# Altium project FTDI ToolKit.PrjPCB
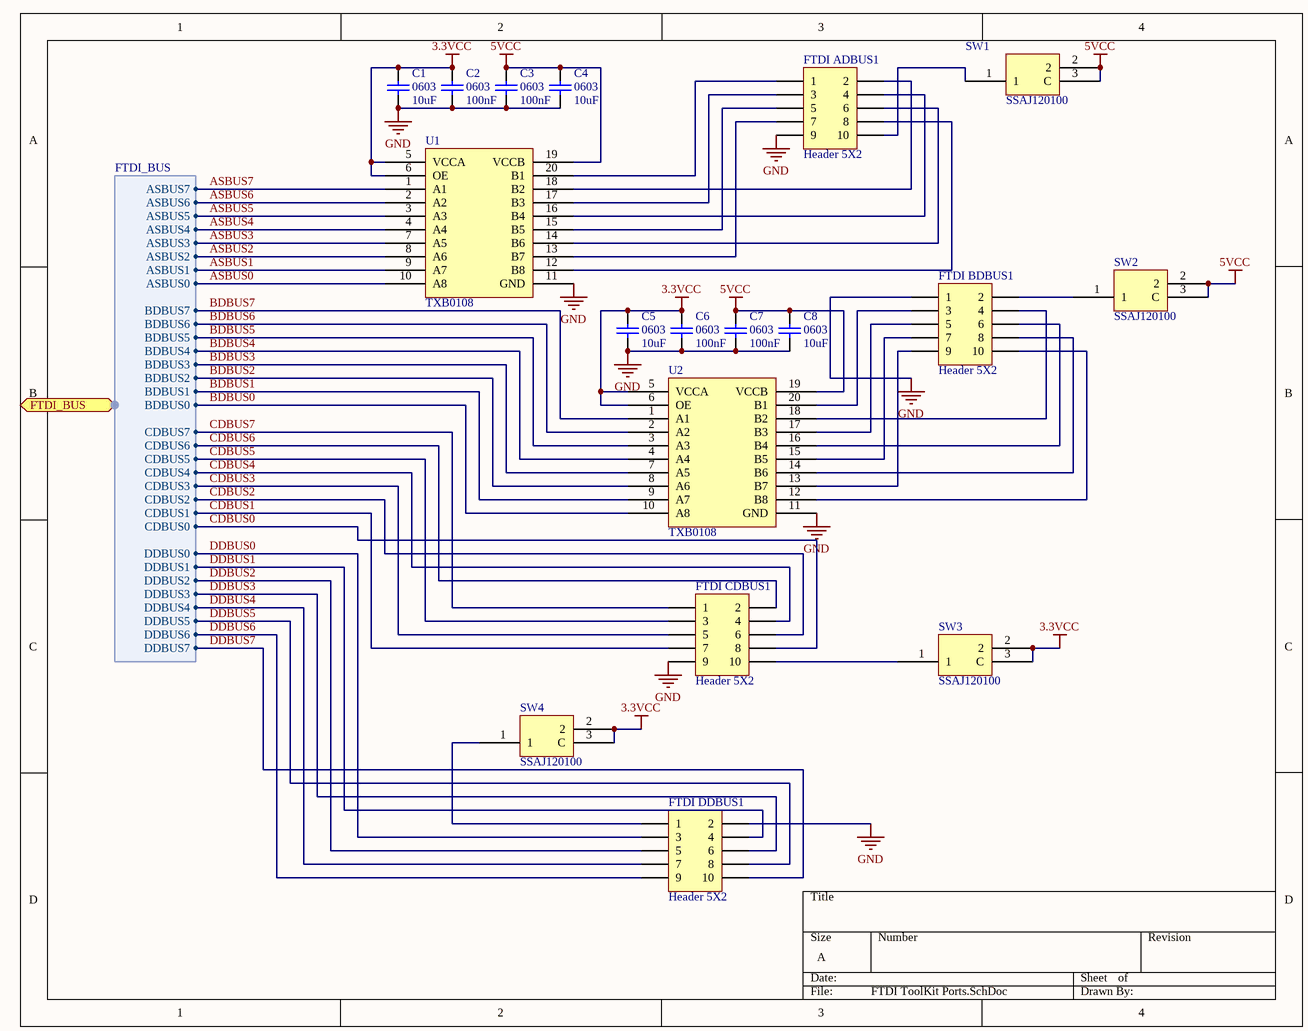
[diagram p0: FTDI ToolKit Ports.SchDoc]
2 sheets, 82 parts. Net scope: flat (ports and power ports of the same name join across sheets).
Board file: FTDI ToolKit.PcbDoc
Sheets:
  FTDI ToolKit Ports.SchDoc
  FTDI ToolKit FTDI & USB.SchDoc

## Sheet FTDI ToolKit Ports.SchDoc
size A

### Parts
C1  0603  value 10uF  [1608[0603]]
C2  0603  value 100nF  [1608[0603]]
C3  0603  value 100nF  [1608[0603]]
C4  0603  value 10uF  [1608[0603]]
C5  0603  value 10uF  [1608[0603]]
C6  0603  value 100nF  [1608[0603]]
C7  0603  value 100nF  [1608[0603]]
C8  0603  value 10uF  [1608[0603]]
FTDI_ADBUS1  Header 5X2  [HDR2X5]
FTDI_BDBUS1  Header 5X2  [HDR2X5]
FTDI_CDBUS1  Header 5X2  [HDR2X5]
FTDI_DDBUS1  Header 5X2  [HDR2X5]
SW1  SSAJ120100  [SSAJ120100]
SW2  SSAJ120100  [SSAJ120100]
SW3  SSAJ120100  [SSAJ120100]
SW4  SSAJ120100  [SSAJ120100]
U1  TXB0108  [TXB0108]
U2  TXB0108  [TXB0108]

### Ports
FTDI_BUS (harness FTDI_BUS)

### Harnesses
FTDI_BUS: BDBUS0, BDBUS1, BDBUS2, BDBUS3, BDBUS4, BDBUS5, BDBUS6, BDBUS7, CDBUS0, CDBUS1, CDBUS2, CDBUS3, CDBUS4, CDBUS5, CDBUS6, CDBUS7, DDBUS0, DDBUS1, DDBUS2, DDBUS3, DDBUS4, DDBUS5, DDBUS6, DDBUS7, ASBUS0, ASBUS1, ASBUS2, ASBUS3, ASBUS4, ASBUS5, ASBUS6, ASBUS7

### Nets
3.3VCC: C1.2 C2.2 C5.2 C6.2 SW3.2 SW3.3(C) SW4.2 SW4.3(C) U1.5(VCCA) U1.6(OE) U2.5(VCCA) U2.6(OE)
5VCC: C3.2 C4.2 C7.2 C8.2 SW1.2 SW1.3(C) SW2.2 SW2.3(C) U1.19(VCCB) U2.19(VCCB)
GND: C1.1 C2.1 C3.1 C4.1 C5.1 C6.1 C7.1 C8.1 FTDI_ADBUS1.9 FTDI_BDBUS1.1 FTDI_CDBUS1.9 FTDI_DDBUS1.2 U1.11(GND) U2.11(GND)
ASBUS0: U1.10(A8) ; port FTDI_BUS.ASBUS0
ASBUS1: U1.9(A7) ; port FTDI_BUS.ASBUS1
ASBUS2: U1.8(A6) ; port FTDI_BUS.ASBUS2
ASBUS3: U1.7(A5) ; port FTDI_BUS.ASBUS3
ASBUS4: U1.4(A4) ; port FTDI_BUS.ASBUS4
ASBUS5: U1.3(A3) ; port FTDI_BUS.ASBUS5
ASBUS6: U1.2(A2) ; port FTDI_BUS.ASBUS6
ASBUS7: U1.1(A1) ; port FTDI_BUS.ASBUS7
BDBUS0: U2.10(A8) ; port FTDI_BUS.BDBUS0
BDBUS1: U2.9(A7) ; port FTDI_BUS.BDBUS1
BDBUS2: U2.8(A6) ; port FTDI_BUS.BDBUS2
BDBUS3: U2.7(A5) ; port FTDI_BUS.BDBUS3
BDBUS4: U2.4(A4) ; port FTDI_BUS.BDBUS4
BDBUS5: U2.3(A3) ; port FTDI_BUS.BDBUS5
BDBUS6: U2.2(A2) ; port FTDI_BUS.BDBUS6
BDBUS7: U2.1(A1) ; port FTDI_BUS.BDBUS7
CDBUS0: FTDI_CDBUS1.8 ; port FTDI_BUS.CDBUS0
CDBUS1: FTDI_CDBUS1.7 ; port FTDI_BUS.CDBUS1
CDBUS2: FTDI_CDBUS1.6 ; port FTDI_BUS.CDBUS2
CDBUS3: FTDI_CDBUS1.5 ; port FTDI_BUS.CDBUS3
CDBUS4: FTDI_CDBUS1.4 ; port FTDI_BUS.CDBUS4
CDBUS5: FTDI_CDBUS1.3 ; port FTDI_BUS.CDBUS5
CDBUS6: FTDI_CDBUS1.2 ; port FTDI_BUS.CDBUS6
CDBUS7: FTDI_CDBUS1.1 ; port FTDI_BUS.CDBUS7
DDBUS0: FTDI_DDBUS1.3 ; port FTDI_BUS.DDBUS0
DDBUS1: FTDI_DDBUS1.4 ; port FTDI_BUS.DDBUS1
DDBUS2: FTDI_DDBUS1.5 ; port FTDI_BUS.DDBUS2
DDBUS3: FTDI_DDBUS1.6 ; port FTDI_BUS.DDBUS3
DDBUS4: FTDI_DDBUS1.7 ; port FTDI_BUS.DDBUS4
DDBUS5: FTDI_DDBUS1.8 ; port FTDI_BUS.DDBUS5
DDBUS6: FTDI_DDBUS1.9 ; port FTDI_BUS.DDBUS6
DDBUS7: FTDI_DDBUS1.10 ; port FTDI_BUS.DDBUS7
NetFTDI_ADBUS1_1: FTDI_ADBUS1.1 U1.20(B1)
NetFTDI_ADBUS1_2: FTDI_ADBUS1.2 U1.18(B2)
NetFTDI_ADBUS1_3: FTDI_ADBUS1.3 U1.17(B3)
NetFTDI_ADBUS1_4: FTDI_ADBUS1.4 U1.16(B4)
NetFTDI_ADBUS1_5: FTDI_ADBUS1.5 U1.15(B5)
NetFTDI_ADBUS1_6: FTDI_ADBUS1.6 U1.14(B6)
NetFTDI_ADBUS1_7: FTDI_ADBUS1.7 U1.13(B7)
NetFTDI_ADBUS1_8: FTDI_ADBUS1.8 U1.12(B8)
NetFTDI_ADBUS1_10: FTDI_ADBUS1.10 SW1.1
NetFTDI_BDBUS1_2: FTDI_BDBUS1.2 SW2.1
NetFTDI_BDBUS1_3: FTDI_BDBUS1.3 U2.20(B1)
NetFTDI_BDBUS1_4: FTDI_BDBUS1.4 U2.18(B2)
NetFTDI_BDBUS1_5: FTDI_BDBUS1.5 U2.17(B3)
NetFTDI_BDBUS1_6: FTDI_BDBUS1.6 U2.16(B4)
NetFTDI_BDBUS1_7: FTDI_BDBUS1.7 U2.15(B5)
NetFTDI_BDBUS1_8: FTDI_BDBUS1.8 U2.14(B6)
NetFTDI_BDBUS1_9: FTDI_BDBUS1.9 U2.13(B7)
NetFTDI_BDBUS1_10: FTDI_BDBUS1.10 U2.12(B8)
NetFTDI_CDBUS1_10: FTDI_CDBUS1.10 SW3.1
NetFTDI_DDBUS1_1: FTDI_DDBUS1.1 SW4.1

### Library data of the parts
C1-C8 = Cap Semi: Capacitor (Semiconductor SIM Model); Published: 8-Jun-2000; LatestRevisionDate: 29-May-2009; LatestRevisionNote: IPC-7351 Footprint Added.; PackageReference: C1206; Publisher: Altium Limited; PackageDescription: Chip Capacitor
FTDI_ADBUS1 FTDI_BDBUS1 FTDI_CDBUS1 FTDI_DDBUS1 = Header 5X2: Header, 5-Pin, Dual row; LatestRevisionDate: 17-Jul-2002; LatestRevisionNote: Re-released for DXP Platform.; Publisher: Altium Limited
SW1-SW4 = SSAJ120100: Slide Switch SMD
U1 U2 = TXB0108: Ti TXB0108 Bidirectional Level Translator

## Sheet FTDI ToolKit FTDI & USB.SchDoc
size B
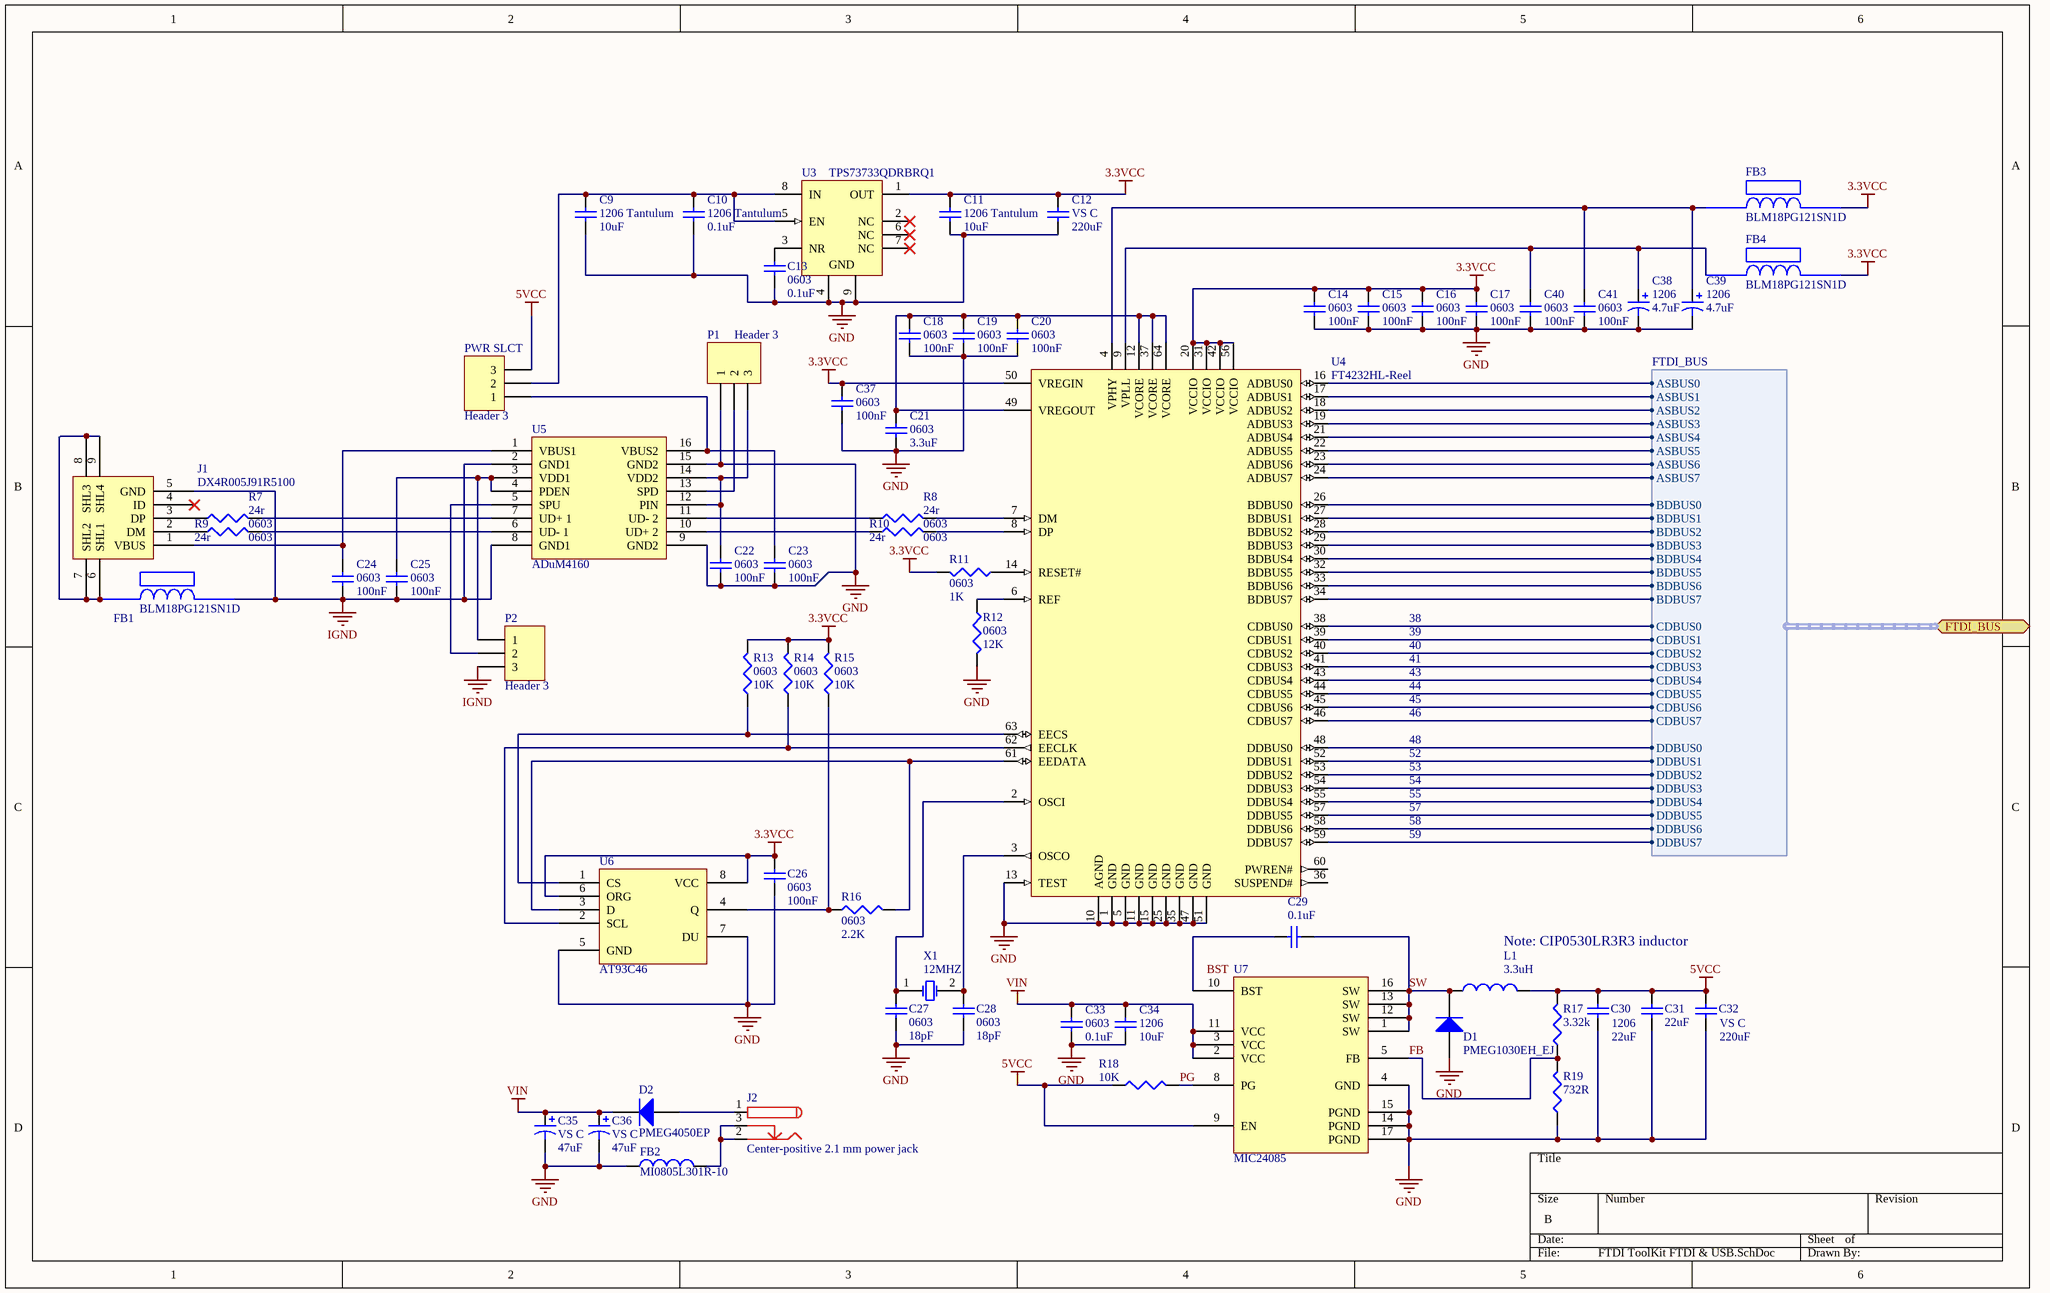
[diagram p1: FTDI ToolKit FTDI & USB.SchDoc]

### Parts
C9  1206 Tantulum  value 10uF  [C1206]
C10  1206 Tantulum  value 0.1uF  [C1206]
C11  1206 Tantulum  value 10uF  [C1206]
C12  VS C  value 220uF  [Panasonic VS C]
C13  0603  value 0.1uF  [1608[0603]]
C14  0603  value 100nF  [1608[0603]]
C15  0603  value 100nF  [1608[0603]]
C16  0603  value 100nF  [1608[0603]]
C17  0603  value 100nF  [1608[0603]]
C18  0603  value 100nF  [1608[0603]]
C19  0603  value 100nF  [1608[0603]]
C20  0603  value 100nF  [1608[0603]]
C21  0603  value 3.3uF  [1608[0603]]
C22  0603  value 100nF  [1608[0603]]
C23  0603  value 100nF  [1608[0603]]
C24  0603  value 100nF  [1608[0603]]
C25  0603  value 100nF  [1608[0603]]
C26  0603  value 100nF  [1608[0603]]
C27  0603  value 18pF  [1608[0603]]
C28  0603  value 18pF  [1608[0603]]
C29  value 0.1uF  [1608[0603]]  (hidden comment: Cap Semi)
C30  1206  value 22uF  [C1206]
C31  value 22uF  [C1206]  (hidden comment: Cap Semi)
C32  VS C  value 220uF  [Panasonic VS C]
C33  0603  value 0.1uF  [1608[0603]]
C34  1206  value 10uF  [C1206]
C35  VS C  value 47uF  [Panasonic VS C]
C36  VS C  value 47uF  [Panasonic VS C]
C37  0603  value 100nF  [1608[0603]]
C38  1206  value 4.7uF  [C1206POL]
C39  1206  value 4.7uF  [C1206POL]
C40  0603  value 100nF  [1608[0603]]
C41  0603  value 100nF  [1608[0603]]
D1  PMEG1030EH_EJ  [PMEG1030EH_EJ]
D2  PMEG4050EP  [PMEG4050EP]
FB1  BLM18PG121SN1D  [BLM18PG121SN1D]
FB2  MI0805L301R-10  [SM 0805 - gap trimmed]
FB3  BLM18PG121SN1D  [BLM18PG121SN1D]
FB4  BLM18PG121SN1D  [BLM18PG121SN1D]
J1  DX4R005J91R5100  [Micro USB Circular Holes Only]
J2  Center-positive 2.1 mm power jack  [PJ-102AH]
L1  value 3.3uH  [CIP0530LR3R3]  (hidden comment: Inductor)
P1  Header 3  [HDR1X3]
P2  Header 3  [HDR1X3]
PWR_SLCT  Header 3  [HDR1X3]
R7  0603  value 24r  [J1-0603]
R8  0603  value 24r  [J1-0603]
R9  0603  value 24r  [J1-0603]
R10  0603  value 24r  [J1-0603]
R11  0603  value 1K  [J1-0603]
R12  0603  value 12K  [J1-0603]
R13  0603  value 10K  [J1-0603]
R14  0603  value 10K  [J1-0603]
R15  0603  value 10K  [J1-0603]
R16  0603  value 2.2K  [J1-0603]
R17  value 3.32k  [J1-0603]  (hidden comment: Res3)
R18  value 10K  [J1-0603]  (hidden comment: Res3)
R19  value 732R  [J1-0603]  (hidden comment: Res3)
U3  TPS73733QDRBRQ1  [TI-DRB8-1750X1500TP_V]
U4  FT4232HL-Reel  [LQFP-64_N]
U5  ADuM4160  [ADuM4160]
U6  AT93C46  [SOIC127P600X175-8N]
U7  MIC24085  [MIC24085-AYML]
X1  12MHZ  [445C35A12M00000]

### Ports
FTDI_BUS (harness FTDI_BUS)

### Harnesses
FTDI_BUS: ASBUS0, ASBUS1, ASBUS2, ASBUS3, ASBUS4, ASBUS5, ASBUS6, ASBUS7, BDBUS0, BDBUS1, BDBUS2, BDBUS3, BDBUS4, BDBUS5, BDBUS6, BDBUS7, CDBUS0, CDBUS1, CDBUS2, CDBUS3, CDBUS4, CDBUS5, CDBUS6, CDBUS7, DDBUS0, DDBUS1, DDBUS2, DDBUS3, DDBUS4, DDBUS5, DDBUS6, DDBUS7

### Nets
3.3VCC: C11.1 C12.1 C14.2 C15.2 C16.2 C17.2 C26.2 C37.2 FB3.2 FB4.2 R11.2 R13.2 R14.2 R15.2 U3.1(OUT) U4.20(VCCIO) U4.31(VCCIO) U4.42(VCCIO) U4.50(VREGIN) U4.56(VCCIO) U6.6(ORG) U6.8(VCC)
5VCC: C30.2 C31.1 C32.1 L1.2 PWR_SLCT.3 R17.2 R18.1 U7.9(EN)
GND: C9.2 C10.1 C11.2 C12.2 C13.1 C14.1 C15.1 C16.1 C17.1 C18.1 C19.1 C20.1 C21.1 C22.1 C23.1 C26.1 C27.1 C28.1 C30.1 C31.2 C32.2 C33.1 C34.1 C35.2 C36.2 C37.1 C38.2 C39.2 C40.1 C41.1 D1.1(A) FB2.1 P1.1 R12.2 R19.1 U3.4(GND) U3.9(GND) U4.1(GND) U4.5(GND) U4.10(AGND) U4.11(GND) U4.13(TEST) U4.15(GND) U4.25(GND) U4.35(GND) U4.47(GND) U4.51(GND) U5.9(GND2) U5.15(GND2) U6.5(GND) U6.7(DU) U7.4(GND) U7.14(PGND) U7.15(PGND) U7.17(PGND)
IGND: C24.1 C25.1 FB1.2 J1.5(GND) P2.3 U5.2(GND1) U5.8(GND1)
VIN: C33.2 C34.2 C35.1 C36.1 D2.1(A) U7.2(VCC) U7.3(VCC) U7.11(VCC)
ASBUS0: U4.16(ADBUS0) ; port FTDI_BUS.ASBUS0
ASBUS1: U4.17(ADBUS1) ; port FTDI_BUS.ASBUS1
ASBUS2: U4.18(ADBUS2) ; port FTDI_BUS.ASBUS2
ASBUS3: U4.19(ADBUS3) ; port FTDI_BUS.ASBUS3
ASBUS4: U4.21(ADBUS4) ; port FTDI_BUS.ASBUS4
ASBUS5: U4.22(ADBUS5) ; port FTDI_BUS.ASBUS5
ASBUS6: U4.23(ADBUS6) ; port FTDI_BUS.ASBUS6
ASBUS7: U4.24(ADBUS7) ; port FTDI_BUS.ASBUS7
BDBUS0: U4.26(BDBUS0) ; port FTDI_BUS.BDBUS0
BDBUS1: U4.27(BDBUS1) ; port FTDI_BUS.BDBUS1
BDBUS2: U4.28(BDBUS2) ; port FTDI_BUS.BDBUS2
BDBUS3: U4.29(BDBUS3) ; port FTDI_BUS.BDBUS3
BDBUS4: U4.30(BDBUS4) ; port FTDI_BUS.BDBUS4
BDBUS5: U4.32(BDBUS5) ; port FTDI_BUS.BDBUS5
BDBUS6: U4.33(BDBUS6) ; port FTDI_BUS.BDBUS6
BDBUS7: U4.34(BDBUS7) ; port FTDI_BUS.BDBUS7
CDBUS0: U4.38(CDBUS0) ; port FTDI_BUS.CDBUS0
CDBUS1: U4.39(CDBUS1) ; port FTDI_BUS.CDBUS1
CDBUS2: U4.40(CDBUS2) ; port FTDI_BUS.CDBUS2
CDBUS3: U4.41(CDBUS3) ; port FTDI_BUS.CDBUS3
CDBUS4: U4.43(CDBUS4) ; port FTDI_BUS.CDBUS4
CDBUS5: U4.44(CDBUS5) ; port FTDI_BUS.CDBUS5
CDBUS6: U4.45(CDBUS6) ; port FTDI_BUS.CDBUS6
CDBUS7: U4.46(CDBUS7) ; port FTDI_BUS.CDBUS7
DDBUS0: U4.48(DDBUS0) ; port FTDI_BUS.DDBUS0
DDBUS1: U4.52(DDBUS1) ; port FTDI_BUS.DDBUS1
DDBUS2: U4.53(DDBUS2) ; port FTDI_BUS.DDBUS2
DDBUS3: U4.54(DDBUS3) ; port FTDI_BUS.DDBUS3
DDBUS4: U4.55(DDBUS4) ; port FTDI_BUS.DDBUS4
DDBUS5: U4.57(DDBUS5) ; port FTDI_BUS.DDBUS5
DDBUS6: U4.58(DDBUS6) ; port FTDI_BUS.DDBUS6
DDBUS7: U4.59(DDBUS7) ; port FTDI_BUS.DDBUS7
FB: R17.1 R19.2 U7.5(FB)
PG: R18.2 U7.8(PG)
SW: C29.1 D1.2(K) L1.1 U7.1(SW) U7.12(SW) U7.13(SW) U7.16(SW)
NetC9_1: C9.1 C10.2 PWR_SLCT.2 U3.5(EN) U3.8(IN)
NetC13_2: C13.2 U3.3(NR)
NetC18_2: C18.2 C19.2 C20.2 C21.2 U4.12(VCORE) U4.37(VCORE) U4.49(VREGOUT) U4.64(VCORE)
NetC22_2: C22.2 P1.3 U5.12(PIN) U5.14(VDD2)
NetC23_2: C23.2 PWR_SLCT.1 U5.16(VBUS2)
NetC24_2: C24.2 J1.1(VBUS) U5.1(VBUS1)
NetC25_2: C25.2 P2.1 U5.3(VDD1) U5.4(PDEN)
NetC27_2: C27.2 U4.2(OSCI) X1.1(OSC1)
NetC28_2: C28.2 U4.3(OSCO) X1.2(OSC2)
NetC29_2: C29.2 U7.10(BST)
NetC38_1: C38.1 C40.2 FB4.1 U4.9(VPLL)
NetC39_1: C39.1 C41.2 FB3.1 U4.4(VPHY)
NetD2_2: D2.2(K) J2.1
NetFB1_1: FB1.1 J1.6(SHL1) J1.7(SHL2) J1.8(SHL3) J1.9(SHL4)
NetFB2_2: FB2.2 J2.2 J2.3
NetJ1_2: J1.2(DM) R9.1
NetJ1_3: J1.3(DP) R7.1
NetP1_2: P1.2 U5.13(SPD)
NetP2_2: P2.2 U5.5(SPU)
NetR7_2: R7.2 U5.7(UD+_1)
NetR8_1: R8.1 U5.11(UD-_2)
NetR8_2: R8.2 U4.7(DM)
NetR9_2: R9.2 U5.6(UD-_1)
NetR10_1: R10.1 U5.10(UD+_2)
NetR10_2: R10.2 U4.8(DP)
NetR11_1: R11.1 U4.14(RESET#)
NetR12_1: R12.1 U4.6(REF)
NetR13_1: R13.1 U4.63(EECS) U6.1(CS)
NetR14_1: R14.1 U4.62(EECLK) U6.2(SCL)
NetR15_1: R15.1 R16.1 U6.4(Q)
NetR16_2: R16.2 U4.61(EEDATA) U6.3(D)

Not connected (* = marked no-connect by the designer): J1 4(ID)*; U3 2(NC)* 6(NC)* 7(NC)*; U4 36(SUSPEND#) 60(PWREN#); U7 6(NC) 7(NC)

### Notes on the sheet
- 38
- 39
- 40
- 41
- 43
- 44
- 45
- 46
- 48
- 52
- 53
- 54
- 55
- 57
- 58
- 59
- Note: CIP0530LR3R3 inductor
- Labels drawn without touching a wire or pin: BST

### Library data of the parts
C9-C34 C37 C40 C41 = Cap Semi: Capacitor (Semiconductor SIM Model); Published: 8-Jun-2000; LatestRevisionDate: 29-May-2009; LatestRevisionNote: IPC-7351 Footprint Added.; PackageReference: C1206; Publisher: Altium Limited; PackageDescription: Chip Capacitor
C35 C36 C38 C39 = Cap Pol3: Polarized Capacitor (Surface Mount); Published: 8-Jun-2000; LatestRevisionDate: 29-May-2009; LatestRevisionNote: IPC-7351 Footprint Added.; PackageReference: C0805; Publisher: Altium Limited; PackageDescription: Chip Capacitor
D1 D2 = Diode: Default Diode; Published: 8-Jun-2000; LatestRevisionDate: 17-Jul-2002; LatestRevisionNote: Re-released for DXP Platform.; PackageVersion: Sep-1996; PackageReference: SMC; Publisher: Altium Limited; PackageDescription: DO-214-AB/SMC; 2 C-Bend Leads; Body 7.9 x 5.9 mm, inc. leads (LxW); Code_JEDEC: DO-214-AB
FB2 L1 = Inductor: Code_IEC: 1005; Published: 8-Jun-2000; PackageReference: 0402-A; Publisher: Altium Limited; Code_JEITA: 0402
  FB2: LatestRevisionDate: 17-Jul-2002; LatestRevisionNote: Re-released for DXP Platform.
  L1: LatestRevisionDate: 29-May-2009; LatestRevisionNote: IPC-7351 Footprint Added.; PackageDescription: Chip Inductor
J1 = Micro USB: Micro USB Jack B
J2 = PWR2.5: Power jack; Published: 17-Dec-2003; DatasheetDocument: 09-May-2002; Publisher: Altium Limited; ComponentLink1Description: Manufacturer Link; ComponentLink1URL: http://domino.kycon.com/internet/Products.html
P1 P2 PWR_SLCT = Header 3: Header, 3-Pin; LatestRevisionDate: 17-Jul-2002; LatestRevisionNote: Re-released for DXP Platform.; Publisher: Altium Limited
R7-R19 = Res3: Resistor; Published: 8-Jun-2000; LatestRevisionDate: 29-May-2009; LatestRevisionNote: IPC-7351 Footprint Added.; PackageReference: J1-0603; Publisher: Altium Limited; PackageDescription: Chip Resistor
U3 = TPS73733QDRBRQ1: Single Output Automotive LDO, 1 A, Fixed 3.3 V Output, 2.2 to 5.5 V Input, with Reverse Current Protection, 8-pin SON (DRB), -40 to 125 degC, Green (RoHS & no Sb/Br); Manufacturer: Texas Instruments; Accuracy(%): 3; Fixed Output Options(V): 3.3; Iout(Max)(A): 1; Iq(Typ)(mA): 0.3; SubFamily: Single Channel LDO; Vdo(Typ)(mV): 130; Vin(Max)(V): 5.5; Vin(Min)(V): 2.2; DatasheetVersion: SBVS123; PackageVersion: 4203482-2/K; PackageReference: DRB8-1750X1500TP; PackageDescription: 8-Pin Plastic Small Outline, Body 3 x 3 mm, Pitch 0.65 mm; Supplier 1: Digi-Key; Supplier Part Number 1: 296-24157-2-ND; Supplier 2: Digi-Key; Supplier Part Number 2: 296-24157-1-ND; Supplier 3: Digi-Key; Supplier Part Number 3: 296-24157-6-ND; Supplier 4: Newark; Supplier Part Number 4: 56P3118; Supplier 5: Mouser; Supplier Part Number 5: 595-TPS73733QDRBRQ1; Eco-Plan: Green (RoHS & no Sb/Br); Rating: Automotive; Vout Adj(Max)(V): 3.3; Vout Adj(Min)(V): 3.3; Mounting Technology: Surface Mount; PartNumber: TPS73733QDRBRQ1; ComponentLink1Description: Manufacturer URL; ComponentLink1URL: http://www.ti.com/; ComponentLink2Description: Datasheet; ComponentLink2URL: http://www.ti.com/general/docs/lit/getliterature.tsp?genericPartNumber=TPS73733-Q1&fileType=pdf; ComponentLink3Description: Package Specification; ComponentLink3URL: http://www.ti.com/litv/pdf/mpds118h
U4 = FT4232HL-Reel: Quad High Speed USB To Multipurpose UART/MPSSE IC, 64-pin LQFP, Tape and Reel; Manufacturer: FTDI; DatasheetVersion: ver 2.2, Jan-2012; PackageVersion: Jan-12; PackageReference: LQFP-64; PackageDescription: 64-Pin Thin Quad Flat Pack, 10 x 10 x 1.4 mm Body, 0.5 mm Pitch; PartNumber: FT4232HL-Reel; ComponentLink1Description: Manufacturer URL; ComponentLink1URL: http://www.ftdichip.com/; ComponentLink2Description: Datasheet; ComponentLink2URL: http://www.ftdichip.com/Support/Documents/DataSheets/ICs/DS_FT4232H.pdf
U5 = ADuM4160: USB Opto Isolator
X1 = XTAL: Crystal Oscillator; Published: 8-Jun-2000; LatestRevisionDate: 17-Jul-2002; LatestRevisionNote: Re-released for DXP Platform.; PackageReference: R38; Publisher: Altium Limited; PackageDescription: Crystal, Thru-Hole; 2 Leads; Body 3.1 x 8.2 mm (Dia.xH)

## Nets that join several sheets
3.3VCC: FTDI ToolKit Ports (12 pins), FTDI ToolKit FTDI & USB (22 pins)
5VCC: FTDI ToolKit Ports (10 pins), FTDI ToolKit FTDI & USB (8 pins)
GND: FTDI ToolKit Ports (14 pins), FTDI ToolKit FTDI & USB (55 pins)
ASBUS0: FTDI ToolKit Ports (U1.10), FTDI ToolKit FTDI & USB (U4.16)
ASBUS1: FTDI ToolKit Ports (U1.9), FTDI ToolKit FTDI & USB (U4.17)
ASBUS2: FTDI ToolKit Ports (U1.8), FTDI ToolKit FTDI & USB (U4.18)
ASBUS3: FTDI ToolKit Ports (U1.7), FTDI ToolKit FTDI & USB (U4.19)
ASBUS4: FTDI ToolKit Ports (U1.4), FTDI ToolKit FTDI & USB (U4.21)
ASBUS5: FTDI ToolKit Ports (U1.3), FTDI ToolKit FTDI & USB (U4.22)
ASBUS6: FTDI ToolKit Ports (U1.2), FTDI ToolKit FTDI & USB (U4.23)
ASBUS7: FTDI ToolKit Ports (U1.1), FTDI ToolKit FTDI & USB (U4.24)
BDBUS0: FTDI ToolKit Ports (U2.10), FTDI ToolKit FTDI & USB (U4.26)
BDBUS1: FTDI ToolKit Ports (U2.9), FTDI ToolKit FTDI & USB (U4.27)
BDBUS2: FTDI ToolKit Ports (U2.8), FTDI ToolKit FTDI & USB (U4.28)
BDBUS3: FTDI ToolKit Ports (U2.7), FTDI ToolKit FTDI & USB (U4.29)
BDBUS4: FTDI ToolKit Ports (U2.4), FTDI ToolKit FTDI & USB (U4.30)
BDBUS5: FTDI ToolKit Ports (U2.3), FTDI ToolKit FTDI & USB (U4.32)
BDBUS6: FTDI ToolKit Ports (U2.2), FTDI ToolKit FTDI & USB (U4.33)
BDBUS7: FTDI ToolKit Ports (U2.1), FTDI ToolKit FTDI & USB (U4.34)
CDBUS0: FTDI ToolKit Ports (FTDI_CDBUS1.8), FTDI ToolKit FTDI & USB (U4.38)
CDBUS1: FTDI ToolKit Ports (FTDI_CDBUS1.7), FTDI ToolKit FTDI & USB (U4.39)
CDBUS2: FTDI ToolKit Ports (FTDI_CDBUS1.6), FTDI ToolKit FTDI & USB (U4.40)
CDBUS3: FTDI ToolKit Ports (FTDI_CDBUS1.5), FTDI ToolKit FTDI & USB (U4.41)
CDBUS4: FTDI ToolKit Ports (FTDI_CDBUS1.4), FTDI ToolKit FTDI & USB (U4.43)
CDBUS5: FTDI ToolKit Ports (FTDI_CDBUS1.3), FTDI ToolKit FTDI & USB (U4.44)
CDBUS6: FTDI ToolKit Ports (FTDI_CDBUS1.2), FTDI ToolKit FTDI & USB (U4.45)
CDBUS7: FTDI ToolKit Ports (FTDI_CDBUS1.1), FTDI ToolKit FTDI & USB (U4.46)
DDBUS0: FTDI ToolKit Ports (FTDI_DDBUS1.3), FTDI ToolKit FTDI & USB (U4.48)
DDBUS1: FTDI ToolKit Ports (FTDI_DDBUS1.4), FTDI ToolKit FTDI & USB (U4.52)
DDBUS2: FTDI ToolKit Ports (FTDI_DDBUS1.5), FTDI ToolKit FTDI & USB (U4.53)
DDBUS3: FTDI ToolKit Ports (FTDI_DDBUS1.6), FTDI ToolKit FTDI & USB (U4.54)
DDBUS4: FTDI ToolKit Ports (FTDI_DDBUS1.7), FTDI ToolKit FTDI & USB (U4.55)
DDBUS5: FTDI ToolKit Ports (FTDI_DDBUS1.8), FTDI ToolKit FTDI & USB (U4.57)
DDBUS6: FTDI ToolKit Ports (FTDI_DDBUS1.9), FTDI ToolKit FTDI & USB (U4.58)
DDBUS7: FTDI ToolKit Ports (FTDI_DDBUS1.10), FTDI ToolKit FTDI & USB (U4.59)